# EasyEDA Pro project ProPrj_辉光管时钟V1.0_2025-10-09.epro, board 电源+控制
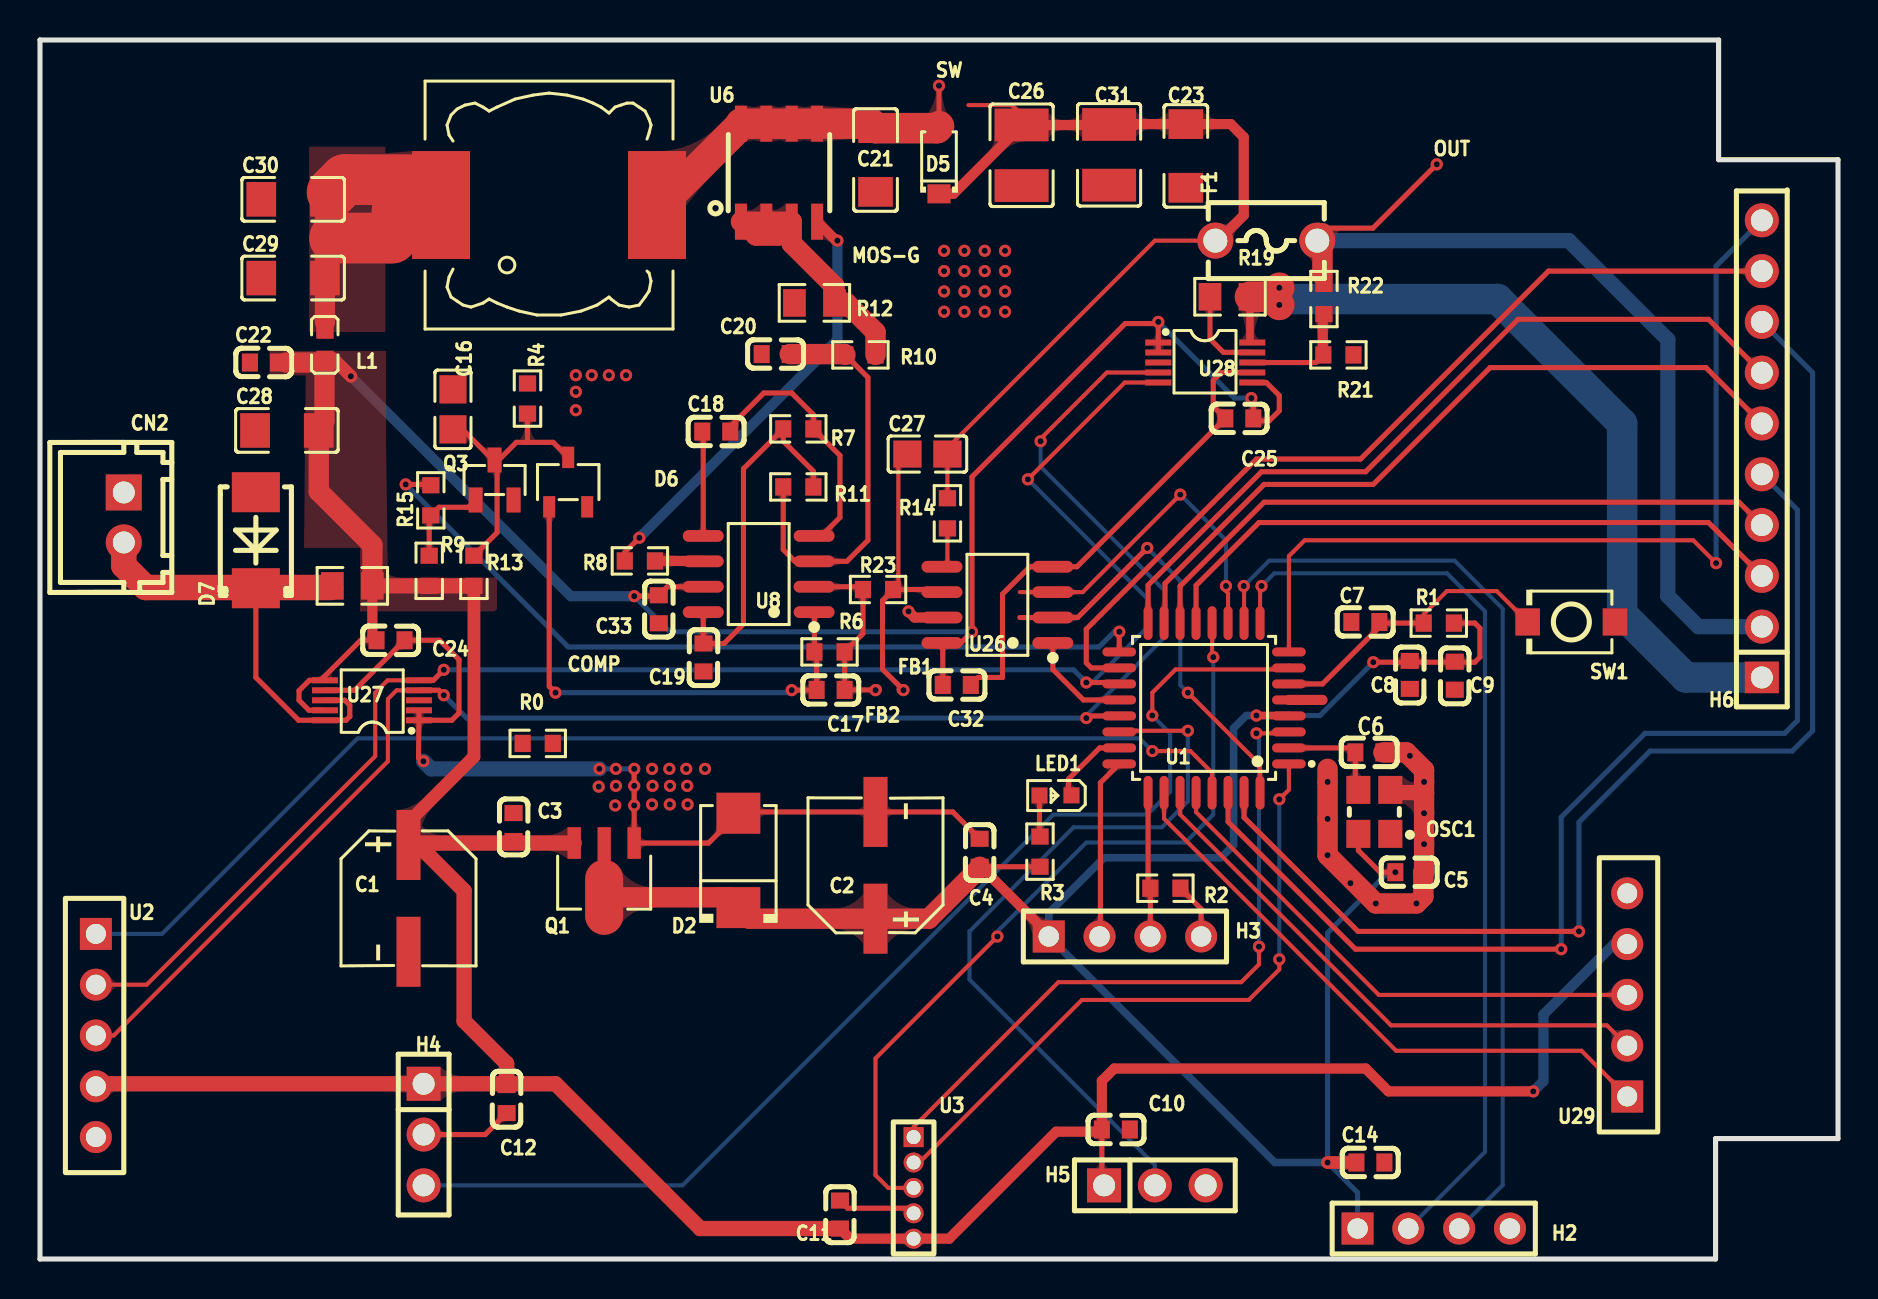
[diagram p6: board, top side]
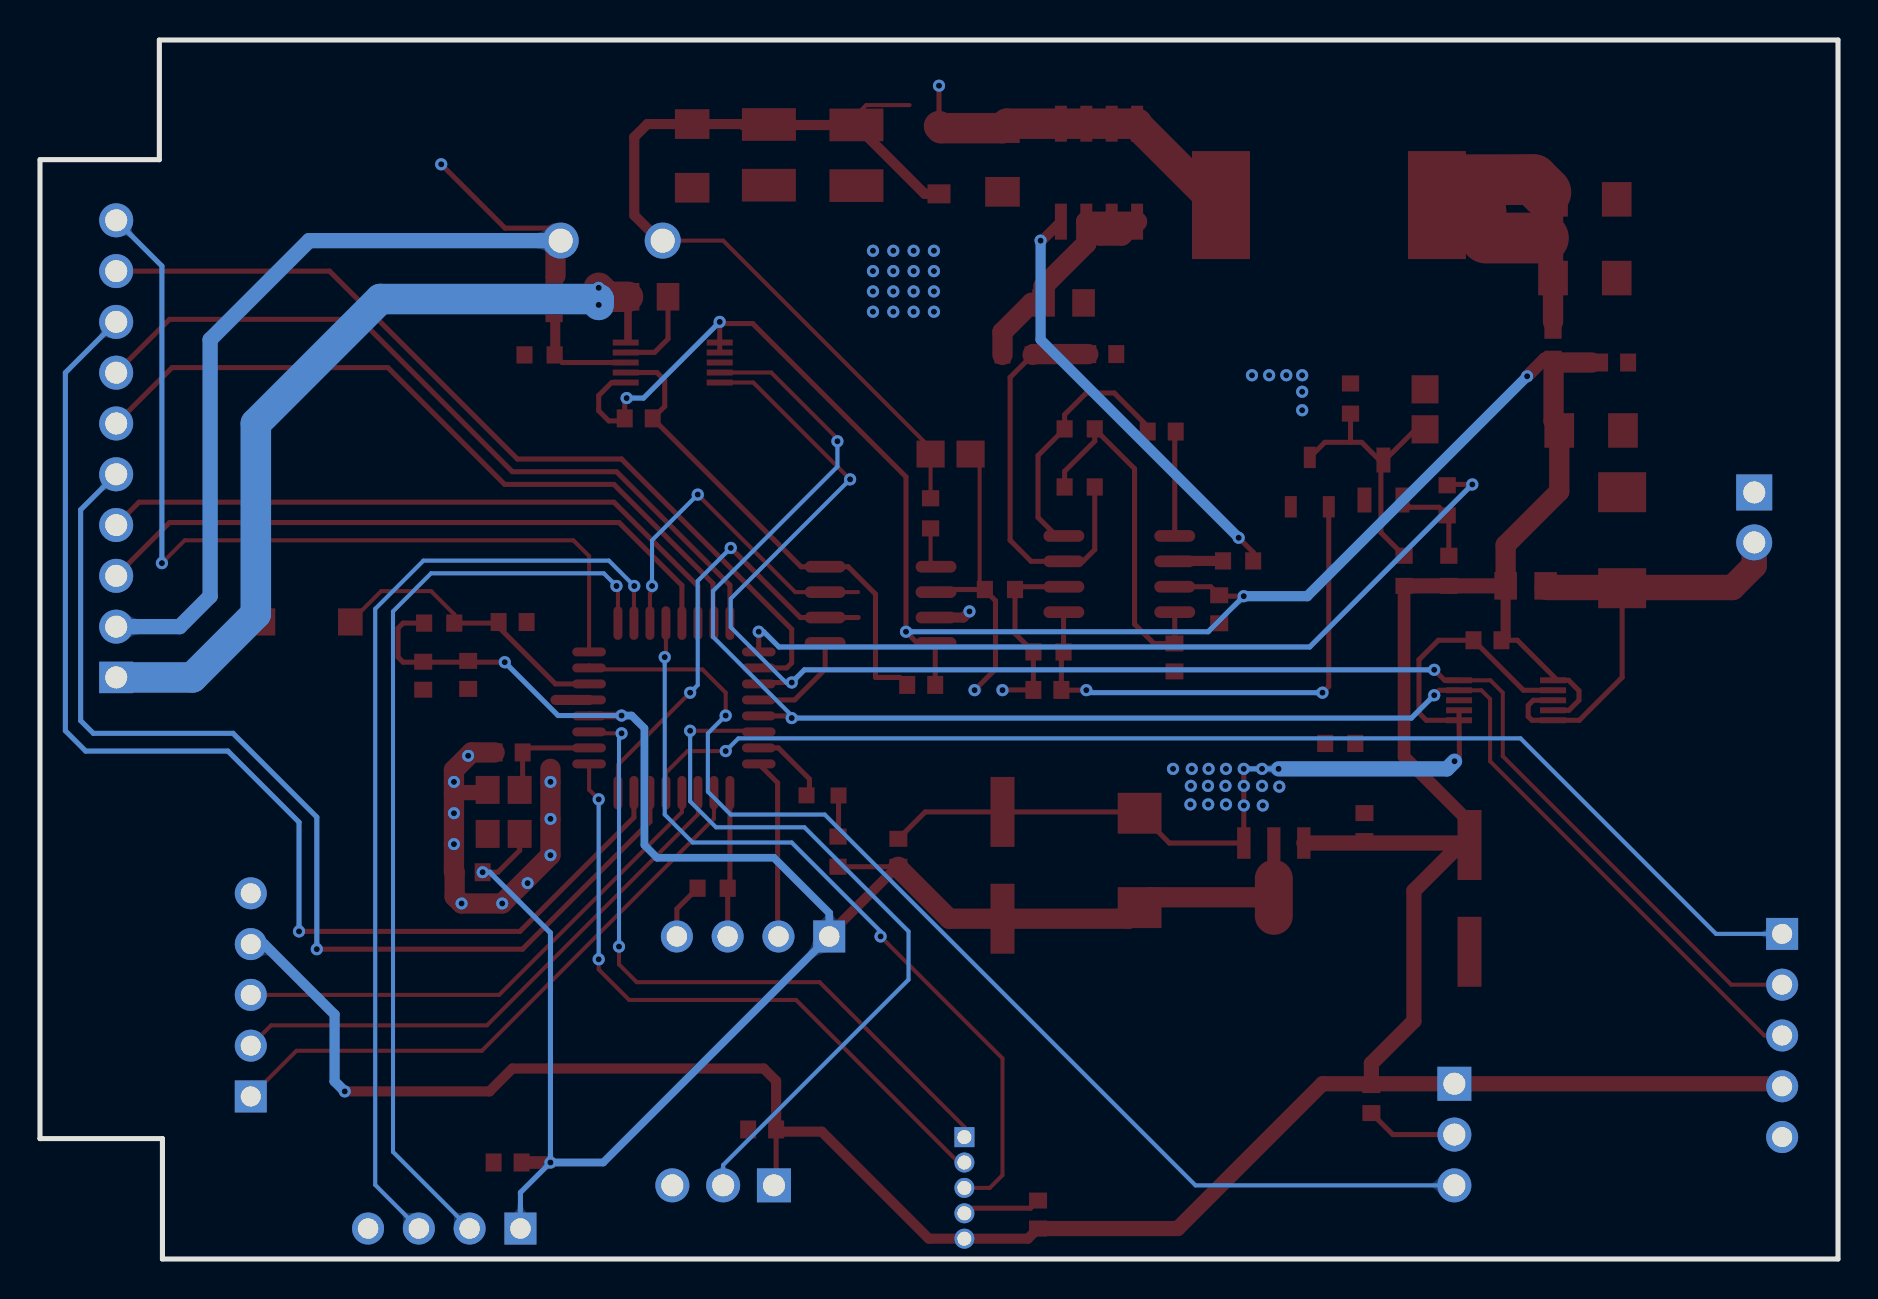
[diagram p7: board, bottom side, seen from below]

Outline 89.92 x 60.96 mm; copper layers: Top Layer, Bottom Layer. Coordinates in mm from the lower left corner of the outline.
Outline path: 0,60.96 0,0 83.79,0 83.79,6.02 89.92,6.02 89.92,54.97 83.95,54.97 83.95,60.96 0,60.96
Stack: Top Layer 0.035mm / Dielectric1 1.51mm FR4 er 4.5 / Bottom Layer 0.035mm

## Design rules (mm)
template: JLCPCB Capability(Two Layers Board)
spacing copperThickness1oz (default): track to track 0.102, other pairs 0.152 to 0.3
spacing copperThickness2oz: track to track 0.203, other pairs 0.152 to 0.3
track width copperThickness1oz (default): min 0.127, default 0.254, max 2.54
track width copperThickness2oz: min 0.203, default 0.254, max 2.54
differential pair differentialPair (default): width min 0.127, default 0.254, max 2.54; gap min 0.152, default 0.152
via viaSize (default): diameter min 0.5, default 0.61, max 10; hole min 0.3, default 0.305, max 6.3

## Placement (name value [footprint] x y rotation side)
C1  220uF  [CAP-SMD_BD6.3-L6.6-W6.6-FD]  18.43 18.03 270 top
C2  220uF  [CAP-SMD_BD6.3-L6.6-W6.6-FD]  41.78 19.69 90 top
C3  100nF  [C0603]  23.68 21.6 270 top
C4  100nF  [C0603]  46.99 20.31 270 top
C5  100nF  [C0603]  68.48 19.34 0 top
C6  15pF  [C0603]  66.48 25.33 0 top
C7  100nF  [C0603]  66.28 31.85 0 top
C8  100nF  [C0603]  68.5 29.21 90 top
C9  2.2nF  [C0603]  70.75 29.17 90 top
C10  100nF  [C0603]  53.8 6.48 180 top
C11  100nF  [C0603]  40 2.22 90 top
C12  100nF  [C0603]  23.34 8 90 top
C14  100nF  [C0603]  66.53 4.83 0 top
C16  47uF  [C0805]  20.65 42.49 270 top
C17  220pF  [c0603]  39.54 28.46 180 top
C18  430pF  [c0603]  33.82 41.38 0 top
C19  0.1uF  [c0603]  33.18 30.08 90 top
C20  1nF  [c0603]  36.79 45.25 0 top
C21  560pF  [c1206]  41.78 54.96 90 top
C22  0.1uF  [c0603]  11.2 44.83 0 top
C23  0.1uF  [c1206]  57.3 55.16 90 top
C24  0.1u  [C0603]  17.53 30.94 180 top
C25  0.1u  [C0603]  59.98 42.04 0 top
C26  2.2uF  [c1210]  49.09 55.2 90 top
C27  100pF  [C0805]  44.38 40.25 0 top
C28  100uF  [c1206]  12.35 41.43 0 top
C29  100uF  [c1206]  12.66 49.05 0 top
C30  100uF  [c1206]  12.66 52.99 0 top
C31  2.2uF  [c1210]  53.46 55.22 90 top
C32  0.1uF  [c0603]  45.85 28.71 180 top
C33  100nF  [C0603]  30.94 32.49 270 top
CN2  ZX-XH2.54-2PZZ  [CONN-TH_2P-P2.50_HX25003-2A]  4.19 37.08 270 top
COMP  -  [Test-Point-0.5mm]  25.8 28.33 0 top
D2  SMBJ3.3A  [SMB_L4.6-W3.6-LS5.3-RD]  34.93 19.93 90 top
D5  ES1J  [sod-123_l2.7-w1.6-ls3.6-rd]  44.96 54.96 90 top
D6  BAT54C,215  [SOT-23-3_L2.9-W1.6-P1.90-LS2.8-BR]  26.42 38.85 270 top
D7  SMBJ5.0A  [SMB_L4.4-W3.6-LS5.3-RD]  10.8 35.95 90 top
F1  JK250-080U  [FUSE-TH_L5.8-W3.8-P5.10-D0.8]  61.33 50.93 0 top
FB1  -  [Test-Point-0.5mm]  43.08 28.47 0 top
FB2  -  [Test-Point-0.5mm]  41.86 28.49 0 top
H2  排针  [SIP-2.54MM-4P-CJT-H8.54]  69.7 1.52 180 top
H3  排针  [SIP-2.54MM-4P-CJT-H8.54]  54.26 16.13 180 top
H4  PZ254V-11-03P  [HDR-TH_3P-P2.54-V-M]  19.19 6.22 270 top
H5  PZ254V-11-03P  [HDR-TH_3P-P2.54-V-M]  55.75 3.68 0 top
H6  MH254V-11-10-1196  [HDR-TH_10P-P2.54-V-M]  86.11 40.51 90 top
L1  10uH  [l0603]  14.25 45.72 90 top
L2  33uH  [33uh功率电感]  25.46 52.7 180 top
LED1  NCD0603R1  [LED0603-RD_RED]  50.78 23.18 180 top
MOS-G  -  [Test-Point-0.5mm]  39.89 50.9 0 top
OSC1  8MHz  [OSC-SMD_4P-L3.2-W2.5-BL-1]  66.73 22.36 90 top
OUT  -  [Test-Point-0.5mm]  69.85 54.75 0 top
Q1  AMS1117-3.3V  [SOT-89-3_L4.5-W2.5-P1.50-LS4.2-BR]  28.21 19.45 90 top
Q3  MMBT5551  [SOT-23-3_L2.9-W1.3-P1.90-LS2.4-BR]  22.73 38.96 270 top
R0  0欧姆  [R0603]  24.89 25.78 0 top
R1  50kΩ  [r0603]  69.95 31.8 0 top
R2  10kΩ  [r0603]  56.28 18.54 180 top
R3  220Ω  [r0603]  50.01 20.37 90 top
R4  100kΩ  [r0603]  24.38 43.03 270 top
R5  100mΩ  [R0805]  15.62 33.66 180 top
R6  10KΩ  [r0603]  39.48 30.36 180 top
R7  60.4kΩ  [r0603]  37.92 41.51 180 top
R8  2Ω  [r0603]  30 34.91 0 top
R9  100kΩ  [r0603]  19.46 34.41 270 top
R10  10kΩ  [r0603]  41.03 45.21 180 top
R11  51KΩ  [r0603]  37.92 38.61 0 top
R12  100mΩ  [R0805]  38.73 47.81 0 top
R13  2kΩ  [r0603]  21.7 34.41 270 top
R14  400kΩ  [r0603]  45.38 37.29 90 top
R15  1kΩ  [r0603]  19.54 37.94 90 top
R19  100mΩ  [R0805]  59.51 48.12 0 top
R21  1MΩ  [r0603]  64.93 45.21 0 top
R22  9.1MΩ  [r0603]  64.21 48.01 270 top
R23  5KΩ  [r0603]  41.91 33.48 180 top
SW  -  [Test-Point-0.5mm]  44.96 58.67 0 top
SW1  TS-1088R-02026  [SW-SMD_L3.9-W3.0-P4.45]  76.58 31.86 180 top
U1  STM32G070KBT6  [LQFP-32_L7.0-W7.0-P0.80-LS9.0-BL]  58.21 27.56 90 top
U2  -  [2.54mm1*5]  2.79 11.18 270 top
U3  FH1.27-01-5PZD  [HDR-TH_5P-P1.27-V-M]  43.69 3.56 270 top
U6  FDS2672  [SO-8_L4.9-W3.9-P1.27-LS6.0-BL]  36.96 54.33 0 top
U8  UCC3803D  [SOIC-8_L4.9-W3.9-P1.27-LS6.0-BL]  35.94 34.25 90 top
U26  MCP41010T-I/SN  [SOIC-8_L4.9-W3.9-P1.27-LS6.0-BL]  47.88 32.71 90 top
U27  INA220AIDGSR  [VSSOP-10_L3.0-W3.0-P0.50-LS4.9-BL]  16.6 27.94 90 top
U28  INA220AIDGSR  [VSSOP-10_L3.0-W3.0-P0.50-LS4.9-BL]  58.27 44.83 270 top
U29  -  [2.54mm1*5]  79.38 13.21 90 top

## Footprints (pads in the part's own frame, mm; a bottom-side part is the same pattern mirrored in y, then rotated)
2.54mm1*5
  rect 1.6x1.6 hole 1: 1(-5.08,0)
  round 1.6 hole 1: 2(-2.54,0) 3(0,0) 4(2.54,0) 5(5.08,0)
33uh功率电感
  rect 2.9x5.4 smd: 1(5.4,0) 2(-5.4,0)
c0603
  rect 0.8x0.9 smd: 1(-0.7,0) 2(0.7,0)
C0603
  rect 0.8x0.9 smd: 1(-0.7,0) 2(0.7,0)
C0805
  rect 1.41x1.35 smd: 1(-1,0) 2(1,0)
c1206
  rect 1.485x1.728 smd: 1(-1.593,0) 2(1.593,0)
c1210
  rect 1.635x2.7 smd: 1(-1.518,0) 2(1.518,0)
CAP-SMD_BD6.3-L6.6-W6.6-FD
  rect 3.5x1.2 smd: 1(-2.67,0) 2(2.67,0)
CONN-TH_2P-P2.50_HX25003-2A
  rect 1.8x1.8 hole 1.1: 1(-1.25,0)
  round 1.8 hole 1.1: 2(1.25,0)
FUSE-TH_L5.8-W3.8-P5.10-D0.8
  round 1.8 hole 1.2: 1(-2.55,0) 2(2.55,0)
HDR-TH_3P-P2.54-V-M
  rect 1.7x1.7 hole 1.1: 1(-2.54,0)
  round 1.7 hole 1.1: 2(0,0) 3(2.54,0)
HDR-TH_5P-P1.27-V-M
  rect 1x1 hole 0.7: 1(-2.54,0)
  round 1 hole 0.7: 2(-1.27,0) 3(0,0) 4(1.27,0) 5(2.54,0)
HDR-TH_10P-P2.54-V-M
  rect 1.575x1.7 hole 1.1: 1(-11.43,0)
  round 1.7 hole 1.1: 2(-8.89,0) 3(-6.35,0) 4(-3.81,0) 5(-1.27,0) 6(1.27,0) 7(3.81,0) 8(6.35,0) 9(8.89,0) 10(11.43,0)
l0603
  rect 0.8x0.864 smd: 1(-0.7,0) 2(0.7,0)
LED0603-RD_RED
  rect 0.8x0.8 smd: 1(-0.799,-0.004) 2(0.799,0.004)
LQFP-32_L7.0-W7.0-P0.80-LS9.0-BL
  oval 0.448x1.684 smd: 1(-2.8,-4.242) 2(-2,-4.242) 3(-1.2,-4.242) 4(-0.4,-4.242) 5(0.4,-4.242) 6(1.2,-4.242) 7(2,-4.242) 8(2.8,-4.242) 17(2.8,4.242) 18(2,4.242) 19(1.2,4.242) 20(0.4,4.242) 21(-0.4,4.242) 22(-1.2,4.242) 23(-2,4.242) 24(-2.8,4.242)
  oval 1.684x0.448 smd: 9(4.242,-2.8) 10(4.242,-2) 11(4.242,-1.2) 12(4.242,-0.4) 13(4.242,0.4) 14(4.242,1.2) 15(4.242,2) 16(4.242,2.8) 25(-4.242,2.8) 26(-4.242,2) 27(-4.242,1.2) 28(-4.242,0.4) 29(-4.242,-0.4) 30(-4.242,-1.2) 31(-4.242,-2) 32(-4.242,-2.8)
OSC-SMD_4P-L3.2-W2.5-BL-1
  rect 1.4x1.2 smd: 1(-1.1,-0.8) 2(1.1,-0.8) 3(1.1,0.8) 4(-1.1,0.8)
r0603
  rect 0.806x0.864 smd: 1(-0.753,0) 2(0.753,0)
R0603
  rect 0.806x0.864 smd: 1(-0.753,0) 2(0.753,0)
R0805
  rect 1.133x1.377 smd: 1(-1,0) 2(1,0)
SIP-2.54MM-4P-CJT-H8.54
  rect 1.6x1.6 hole 1.02: 1(3.81,0)
  round 1.6 hole 1.02: 2(1.27,0) 3(-1.27,0) 4(-3.81,0)
SMB_L4.4-W3.6-LS5.3-RD
  rect 2x2.4 smd: 1(-2.4,0) 2(2.4,0)
SMB_L4.6-W3.6-LS5.3-RD
  rect 2.047x2.192 smd: 1(-2.361,0) 2(2.361,0)
SO-8_L4.9-W3.9-P1.27-LS6.0-BL
  rect 0.6x1.8 smd: 1(-1.905,-2.45) 2(-0.635,-2.45) 3(0.635,-2.45) 4(1.905,-2.45) 5(1.905,2.45) 6(0.635,2.45) 7(-0.635,2.45) 8(-1.905,2.45)
sod-123_l2.7-w1.6-ls3.6-rd
  rect 0.95x1.15 smd: 1(-1.692,0) 2(1.692,0)
SOIC-8_L4.9-W3.9-P1.27-LS6.0-BL
  oval 0.588x2.045 smd: 1(-1.905,-2.772) 2(-0.635,-2.772) 3(0.635,-2.772) 4(1.905,-2.772) 5(1.905,2.772) 6(0.635,2.772) 7(-0.635,2.772) 8(-1.905,2.772)
SOT-23-3_L2.9-W1.3-P1.90-LS2.4-BR
  rect 1.25x0.7 smd: 1(1,-0.95) 2(1,0.95) 3(-1,0)
SOT-23-3_L2.9-W1.6-P1.90-LS2.8-BR
  rect 1.07x0.6 smd: 1(1.235,-0.95) 2(1.235,0.95) 3(-1.235,0)
SOT-89-3_L4.5-W2.5-P1.50-LS4.2-BR
  rect 1.575x0.672 smd: 1(1.356,-1.5) 3(1.356,1.5)
  custom 5.377x1.9 smd: 2(-1.356,0)
SW-SMD_L3.9-W3.0-P4.45
  rect 1.23x1.36 smd: 1(-2.185,0) 2(2.185,0)
Test-Point-0.5mm
  round 0.5 smd: 1(0,0)
VSSOP-10_L3.0-W3.0-P0.50-LS4.9-BL
  rect 0.3x1.3 smd: 1(-1,-2.35) 2(-0.5,-2.35) 3(0,-2.35) 4(0.5,-2.35) 5(1,-2.35) 6(1,2.35) 7(0.5,2.35) 8(0,2.35) 9(-0.5,2.35) 10(-1,2.35)

## Nets
As in the schematic, except:
17V: R21.1 R22.2 U28.8
170V: F1.2 H6.2 OUT.1 R22.1
+3.3V: C2.1 C4.2 C5.1 C8.2 C9.2 C14.1 D2.1 H2.1 H3.1 OSC1.4 Q1.2 R1.2 R3.1 U1.4
GND: C2.2 C4.1 C5.2 C6.2 C7.1 C8.1 C9.1 C10.1 C11.2 C12.1 C14.2 C18.1 C19.1 C24.1 C25.1 C32.1 C33.2 D2.2 H2.4 H3.4 H4.2 H5.3 OSC1.2 Q1.1 R0.2 R2.1 SW1.1 U1.5 U2.5 U3.4 U8.5 U26.4 U27.1 U27.2 U27.7 U28.7 U29.5
PGND: C1.2 C3.1 C16.1 C20.1 C21.1 C22.1 C23.1 C26.1 C28.1 C29.1 C30.1 C31.1 CN2.1 D7.2 Q3.2 R0.1 R4.1 R12.1 R19.1 R21.2 U26.7 U28.9
POWER: R15.2 U1.17

Pads without a net: D6 2; OSC1 1; U27 3; U28 3

## Via types
v1: diameter 0.61, hole 0.305, Top Layer to Bottom Layer, 98 vias

## Routing (per net, layer and track width the routed paths; a pad name or vN(x,y) marks a point on that pad's centre or on a via; arc(x,y) is an arc through that point)
17V: length 5.9
  Top Layer w0.254: 64.15,45.19 63.8,44.83 U28.8 ; 64.17,45.2 R21.1
  Top Layer w0.508: 64.14,47.42 64.14,47.26 64.15,47.24 64.15,45.22 ; 64.17,45.2 64.15,45.19
170V: length 47.1
  Top Layer w0.254: v1(69.85,54.75) 66.66,51.55 63.88,51.55
  Top Layer w1.016: 64.14,49.18 64.14,51.3
  Bottom Layer w0.762: 63.88,50.93 76.45,50.93 81.41,45.97 81.41,33.15 82.93,31.62 H6.2
+3.3V: length 107.5
  Top Layer w0.254: 50.01,19.62 46.99,19.62 C4.2 ; R1.2 71.75,31.8 72.01,31.55 72.01,30.1 71.75,29.84 v1(66.68,29.84) ; OSC1.4 65.93,20.43 67.02,19.34 v1(67.78,19.34)
  Top Layer w0.381: v1(60.83,27.18) 62.44,27.18 U1.4
  Top Layer w0.508: H3.1 50.45,16.23 47.12,19.56 46.99,19.56
  Top Layer w0.635: C14.1 v1(64.39,4.83)
  Top Layer w1.016: 28.21,18.09 34.41,18.09 D2.1 35.48,17.02 C2.1 44.45,17.02 46.99,19.56 C4.2
  Bottom Layer w0.254: v1(67.78,19.34) 67.42,19.34 64.39,16.31 v1(64.39,4.83) 65.89,3.32 H2.1 ; v1(66.68,29.84) 64.01,27.18 v1(60.83,27.18)
  Bottom Layer w0.381: v1(60.83,27.18) 60.33,27.18 59.69,26.54 59.69,20.7 59.06,20.07 53.21,20.07 50.45,17.3 H3.1 61.75,4.83 v1(64.39,4.83)
+5V: length 237.7
  Top Layer w0.254: U28.2 U28.1 55.92,46.78 ; U27.9 13.45,27.44 12.95,27.94 12.95,28.42 13.47,28.94 14.03,28.94 ; C24.2 16.04,30.94 14.03,28.94 ; H5.1 53.1,3.79 53.1,6.37 ; U27.6 14.03,28.94 ; v1(60.58,43.05) 60.68,42.96 C25.2 60.8,41.91 61.47,41.91 61.98,42.42 61.98,43.18 61.33,43.83 U28.6 ; C32.2 45.15,30.77 U26.8 46.05,30.81 v1(46.61,31.37) 46.61,39.12 54.27,46.78 55.92,46.78 ; U8.7 31.37,33.62 C33.1 30.9,33.15 v1(29.72,33.15) ; 55.92,46.78 v1(55.92,46.86)
  Top Layer w0.508: 40,1.52 40.51,1.02 U3.5 45.47,1.02 50.82,6.37 53.1,6.37 53.1,8.91 53.72,9.53 66.29,9.53 67.44,8.38 v1(74.68,8.38) ; C24.2 16.62,31.15 R5.1
  Top Layer w0.635: v1(15.55,44.14) 14.67,45.02 L1.1 ; R13.2 21.7,25.12 18.43,21.84 C1.1
  Top Layer w0.762: 40,1.52 33.02,1.52 25.78,8.76 23.4,8.76 C12.2 ; C12.2 23.27,8.76 H4.1 2.92,8.76 U2.4 ; C12.2 23.34,9.78 21.21,11.9 21.21,18.42 18.92,20.7 C1.1 18.53,20.8 26.71,20.8 ; R5.1 R9.2 R13.2
  Top Layer w1.016: R5.1 16.62,35.7 13.94,38.38 C28.2 13.94,41.63 14.22,41.91 14.22,44.7 ; 14.1,44.83 12.32,44.83
  Bottom Layer w0.254: v1(55.92,46.86) 59.73,43.05 v1(60.58,43.05) ; v1(29.72,33.15) 31.5,31.37 v1(46.61,31.37)
  Bottom Layer w0.508: U29.4 78.71,15.75 75.18,12.22 75.18,8.89 v1(74.68,8.38) ; v1(15.55,44.14) 26.54,33.15 v1(29.72,33.15)
GND: length 112.7
  Top Layer w0.254: v1(19.18,24.89) 18.93,25.06 U27.1 ; C4.1 45.65,22.36 C2.2 34.99,22.36 D2.2 33.43,20.8 29.71,20.8 v1(29.71,22.68) v1(29.71,23.66) 29.71,24.51 v1(29.72,24.51) ; C12.1 22.26,6.22 H4.2 ; 40,2.92 40.39,2.54 43.43,2.54 U3.4 ; H3.4 58.07,17.51 R2.1 ; U28.7 59.06,44.33 58.67,43.94 58.67,42.64 C25.1 51.86,34.62 U26.4 49.5,34.62 48.13,33.25 48.13,29.08 46.92,29.08 C32.1 ; U8.5 33.17,41.33 C18.1 ; U27.2 U27.1 ; U27.1 20.59,26.94 20.96,27.31 20.96,29.97 19.99,30.94 C24.1 15.73,28.44 U27.7 ; 30.78,31.62 C33.2
  Top Layer w0.508: U1.5 64.14,27.96
  Top Layer w0.762: 69.22,23.33 67.53,23.33
  Top Layer w1.016: C6.2 68.33,25.33 69.22,24.45 v1(69.22,23.86) v1(69.22,22.29) v1(69.22,20.75) 69.22,19.38 C5.2 69.18,18.13 v1(68.83,17.78) v1(66.8,17.78) v1(64.39,20.19) v1(64.39,22.01) v1(64.39,23.86) 64.39,24.51
  Bottom Layer w0.254: v1(29.72,24.51) v1(28.8,24.51) v1(27.98,24.51)
  Bottom Layer w0.762: v1(19.18,24.89) 19.56,24.51 v1(27.98,24.51)
  vias: v1(27.94,23.62) v1(28.8,23.66) v1(28.77,22.68) v1(30.61,24.51) v1(30.63,23.66) v1(30.61,22.73) v1(31.47,24.51) v1(31.51,23.66) v1(31.5,22.73) v1(32.32,24.51) v1(32.37,23.66) v1(32.39,22.73) v1(33.26,24.51) v1(65.53,18.8) v1(68.5,25.16)
PGND: length 6.3
  Top Layer w0.254: R19.1 58.51,46.01 59.18,45.34 60.62,45.34 U28.9
  Top Layer w0.508: v1(43.43,32.39) 43.74,32.08 U26.7
  vias: v1(26.8,44.2) v1(26.8,43.37) v1(26.8,42.45) v1(27.59,44.2) v1(28.45,44.2) v1(29.31,44.2) v1(45.21,50.42) v1(45.21,49.4) v1(45.21,48.39) v1(45.21,47.37) v1(46.23,50.42) v1(46.23,49.4) v1(46.23,48.39) v1(46.23,47.37) v1(47.24,50.42) v1(47.24,49.4) v1(47.24,48.39) v1(47.24,47.37) v1(48.26,50.42) v1(48.26,49.4) v1(48.26,48.39) v1(48.26,47.37)
VBUS: length 23.4
  Top Layer w0.254: U27.8 15.24,27.94 15.49,27.69 15.49,27.13 15.3,26.94 U27.10 12.94,26.94 10.8,29.08 10.8,33.54 10.75,33.58
  Top Layer w1.27: 4.19,35.2 4.19,34.67 5.28,33.58 14.54,33.58
170_GND: length 42.2
  Top Layer w0.381: R19.2 60.51,45.95
  Top Layer w1.524: R19.2 61.53,48.12 v1(61.98,48.57) ; v1(61.98,47.71) 61.57,48.12
  Bottom Layer w1.524: H6.1 82.3,29.08 79.12,32.26 79.12,41.78 72.9,48.01 61.99,48.01 61.98,47.99 v1(61.98,47.71)
BLE_RX: length 48.2
  Top Layer w0.203: U1.10 60.21,33.64 v1(60.2,33.66)
  Bottom Layer w0.203: v1(60.2,33.66) 61.47,34.93 70.74,34.93 73.15,32.51 73.15,3.71 H2.3
BLE_TX: length 46.6
  Top Layer w0.203: U1.9 61.01,33.58 v1(61.09,33.66)
  Bottom Layer w0.203: H2.2 72.26,5.36 72.26,32.39 70.36,34.29 61.72,34.29 v1(61.09,33.66)
CLK: length 26.3
  Top Layer w0.203: U29.3 66.95,13.21 57.81,22.35 U1.28
COLON1: length 54.2
  Top Layer w0.254: v1(76.07,15.49) 65.79,15.49 59.41,21.87 59.41,23.32
  Bottom Layer w0.254: H6.5 87.88,37.47 87.88,26.92 87.25,26.29 80.26,26.29 76.07,22.1 v1(76.07,15.49)
COLON2: length 60.9
  Top Layer w0.254: U1.31 60.21,22.08 65.91,16.38 v1(76.96,16.38)
  Bottom Layer w0.254: v1(76.96,16.38) 76.96,21.84 80.52,25.4 87.63,25.4 88.65,26.42 88.65,44.32 H6.8
CS: length 28.2
  Top Layer w0.203: U1.27 57.01,22.23 67.56,11.68 78.36,11.68 U29.2
DS3231: length 61.6
  Top Layer w0.203: v1(55.63,25.4) 57.53,25.4 58.61,24.32 U1.29
  Bottom Layer w0.203: U2.1 6.1,16.26 15.88,26.04 54.99,26.04 v1(55.63,25.4)
I2C1_SCL: length 82.4
  Top Layer w0.203: v1(49.4,38.99) 54.25,43.83 U28.5 ; U27.5 17.38,28.94 16.76,28.32 16.76,25.15 5.34,13.72 U2.2
  Top Layer w0.254: v1(52.32,28.83) 53.9,28.83 U1.19 ; v1(20.19,29.46) 19.67,28.94 U27.5
  Bottom Layer w0.203: v1(49.4,38.99) 55.37,33.02 55.37,31.59 52.61,28.83 v1(52.32,28.83)
  Bottom Layer w0.254: v1(52.32,28.83) 51.69,29.46 v1(20.19,29.46)
I2C1_SDA: length 86.2
  Top Layer w0.203: U2.3 3.68,11.18 17.4,24.89 17.4,28 17.84,28.44 U27.4 ; U28.4 53.35,44.33 50.04,41.02 v1(50.04,40.89)
  Top Layer w0.254: U1.21 52.43,27.16 v1(52.32,27.05) ; U27.4 19.95,28.44 v1(20.19,28.19)
  Bottom Layer w0.203: v1(50.04,40.89) 50.04,39.62 56.26,33.4 56.26,31.12 52.32,27.18 v1(52.32,27.05)
  Bottom Layer w0.254: v1(52.32,27.05) 21.34,27.05 v1(20.19,28.19)
INFRARED-RAY: length 37.1
  Top Layer w0.203: U1.22 54.03,26.42 v1(57.4,26.42)
  Bottom Layer w0.203: H5.2 55.75,4.7 46.48,13.97 46.48,16.38 51.69,21.59 56.11,21.59 57.4,22.89 v1(57.4,26.42)
LED: length 4.1
  Top Layer w0.254: U1.23 52.99,25.56 51.44,24 51.44,23.33 LED1.1
LIGHT_ADC: length 58.2
  Top Layer w0.203: v1(55.63,27.18) 55.63,28.32 56.79,29.48 62.25,29.48 62.46,29.69
  Bottom Layer w0.203: H4.3 32.13,3.68 50.67,22.23 55.37,22.23 56.52,23.37 56.52,26.29 v1(55.63,27.18)
MOSI: length 30.2
  Top Layer w0.203: U29.1 77.09,10.41 67.82,10.41 56.21,22.02 U1.26
NRST: length 14.6
  Top Layer w0.203: R1.1 69.2,32.24 70.36,33.4 72.85,33.4 SW1.2
  Top Layer w0.254: 69.07,31.8 67.03,31.8 C7.2 ; U1.6 64.14,28.76 66.98,31.6
OSC_IN: length 5.6
  Top Layer w0.254: 65.85,23.4 65.93,23.33 OSC1.3 65.78,23.61 C6.1 65.55,25.56 U1.2
POWER: length 41.7
  Top Layer w0.254: U1.17 53.97,31.37 v1(53.97,31.37) ; R15.2 19.5,38.73 v1(18.29,38.73)
  Bottom Layer w0.254: v1(53.97,31.37) 53.72,31.37 52.96,30.61 26.42,30.61 v1(18.29,38.73)
RADER: length 34.4
  Top Layer w0.203: v1(60.83,26.29) 62.39,26.29 U1.3 ; U3.1 43.69,6.6 50.93,13.84 60.07,13.84 60.96,14.73 v1(60.96,15.62)
  Bottom Layer w0.203: v1(60.83,26.29) 60.96,26.16 v1(60.96,15.62)
RADER_RX: length 32.8
  Top Layer w0.203: v1(61.98,22.99) 62.46,23.47 U1.1 ; v1(61.98,14.99) 61.98,14.48 60.45,12.95 52.1,12.95 43.98,4.83 43.69,4.83
  Bottom Layer w0.203: v1(61.98,14.99) v1(61.98,22.99)
RADER_TX: length 39.7
  Top Layer w0.203: v1(58.67,30.1) 58.61,30.16 U1.12 ; v1(47.88,16.13) 41.78,10.03 41.78,4.19 42.42,3.56 U3.3
  Bottom Layer w0.203: v1(47.88,16.13) 47.88,16.38 52.32,20.83 57.28,20.83 58.67,22.23 v1(58.67,30.1)
SPI_CS: length 5.3
  Top Layer w0.254: U1.20 52.18,27.96 50.65,29.49 U26.1
SPI_MOSI: length 17.4
  Top Layer w0.203: 59.18,33.53 59.41,33.3 59.41,31.8 ; 49,33.35 U26.3 52.15,33.35 v1(57.02,38.23)
  Bottom Layer w0.203: v1(59.31,33.66) 59.31,35.94 v1(57.02,38.23)
SPI_SCK: length 22.4
  Top Layer w0.203: U1.32 61.01,24.71 v1(57.4,28.32)
  Top Layer w0.254: v1(55.37,35.56) 51.89,32.08 49,32.08
  Bottom Layer w0.203: v1(57.4,28.32) 57.02,28.7 57.02,33.91 v1(55.37,35.56)
SWCLK: length 7.2
  Top Layer w0.254: H3.3 R2.2 55.41,18.65 55.41,23.32
SWDIO: length 8.9
  Top Layer w0.254: 53.03,16.26 53.03,23.82 U1.24
SWITCH1: length 32.6
  Top Layer w0.254: H6.3 83.44,36.83 60.96,36.83 57.81,33.68 U1.13
SWITCH2: length 33.2
  Top Layer w0.254: U1.14 57.01,33.65 61.21,37.85 84.96,37.85 H6.4
SWITCH3: length 37.5
  Top Layer w0.254: U1.15 56.26,31.85 56.26,33.78 61.21,38.73 66.68,38.73 72.52,44.58 83.31,44.58 H6.6
SWITCH4: length 39.2
  Top Layer w0.254: 55.41,31.8 55.41,33.7 61.09,39.37 66.29,39.37 73.91,46.99 83.44,46.99 H6.7
SWITCH5: length 44.6
  Top Layer w0.254: H6.9 75.44,49.4 66.04,40.01 60.83,40.01 52.32,31.5 52.32,29.81 52.58,29.56 U1.18
SWITCH6: length 45
  Top Layer w0.203: U1.8 62.46,35.15 63.25,35.94 82.68,35.94 v1(83.82,34.8)
  Bottom Layer w0.254: v1(83.82,34.8) 83.82,49.66 H6.10
$1N3438: length 2.1
  Top Layer w0.254: R3.2 49.98,21.15 LED1.2
$3N2608: length 4.6
  Top Layer w0.254: R9.1 19.46,37.1 R15.1 19.95,37.59 21.42,37.59 Q3.1
$3N2615: length 13
  Top Layer w0.254: 34.27,41.38 36.19,43.31 37.59,43.31 38.68,42.22 38.68,41.51 40,40.18 40,37.08 39.08,36.16 U8.4
$3N2617: length 21.8
  Top Layer w0.254: v1(29.97,36.07) 29.25,35.34 R8.1
  Top Layer w0.508: v1(39.88,50.93) 39.81,50.93 U6.4
  Bottom Layer w0.508: v1(29.97,36.07) 39.88,45.97 v1(39.88,50.93)
$3N2618: length 2.4
  Top Layer w0.508: U8.6 33.15,34.91 R8.2
$3N2620: length 17.8
  Top Layer w0.254: v1(44.96,58.67) D5.2
  Top Layer w1.524: 31.05,52.72 35.05,56.72 U6.8 U6.7 U6.6 U6.5 41.56,56.78 C21.2 44.86,56.55 D5.2
$3N2623: length 14.3
  Top Layer w1.016: U6.3 U6.2 35.12,51.88 ; U6.3 36.9,51.18 35.81,51.18 35.12,51.88 ; U6.3 37.59,50.78 39.73,48.65 R12.2 40.33,47.81 41.78,46.36 R10.1 ; 35.12,51.88 U6.1
$3N2624: length 20.6
  Top Layer w0.254: R11.1 37.17,35.47 37.76,34.89 U8.3 40.35,34.89 41.4,35.94 41.4,44.09 40.28,45.21
  Top Layer w1.016: 40.28,45.21 40.24,45.25 C20.2
$3N2625: length 18.1
  Top Layer w0.254: U8.8 33.17,30.8 C19.2 34.21,30.78 35.18,31.75 35.18,39.52 R7.2 37.17,40.9 38.68,39.39 38.68,38.61
$3N2628: length 13.6
  Top Layer w0.254: 24.38,40.84 23.82,40.84 22.86,39.88 22.86,39.75 ; 24.38,40.84 25.66,40.84 D6.3 26.54,39.96 ; 24.38,40.84 24.38,41.9 ; 22.86,39.75 22.86,36.33 R13.1 ; 22.86,39.75 21.12,41.49 C16.2
$3N2629: length 26.5
  Top Layer w0.254: U8.1 38.73,32.33 R6.2 38.84,30.25 C17.2 38.83,28.45 v1(37.59,28.45) ; D6.1 25.47,28.64 v1(25.78,28.32)
  Bottom Layer w0.254: v1(25.78,28.32) 37.47,28.32 v1(37.59,28.45)
$3N2630: length 18.8
  Top Layer w1.016: C30.2 C29.2 14.25,46.86
  Top Layer w2.032: 17.61,51.05 17.61,52.4 17.78,52.58 19.49,52.58
  Top Layer w2.54: 14.61,53.35 15.25,53.98 19.49,53.97 19.49,52.58 ; 17.61,51.05 14.73,51.05
$3N2637: length 46.5
  Top Layer w0.203: R14.2 C27.2 45.38,40.55 55.75,50.93 F1.1 ; 49.6,56.71 48.6,57.7 46.43,57.7
  Top Layer w0.508: 58.92,51.44 59.18,51.18 60.2,52.2 60.2,56.1 59.54,56.76 C23.2 54.81,56.76 54.76,56.71 49.12,56.71 45.68,53.27 D5.1
$3N2638: length 9.5
  Top Layer w0.254: FB2.1 41.82,28.46 C17.1 40.24,30.36 R6.1 41.16,31.28 R23.2 41.02,33.62 U8.2
  vias: v1(41.78,28.45)
$3N2640: length 2
  Top Layer w0.203: U26.5 45.38,34.89 R14.1
$3N2641: length 15.3
  Top Layer w0.203: C27.1 42.93,39.8 42.93,33.74 R23.1
  Top Layer w0.254: v1(43.18,28.45) 42.13,29.5 42.13,32.92 42.66,33.45 R23.1 44.98,33.48 U26.6

## Copper pours and planes (outline as drawn; the poured copper is in the pictures)
+5V on Top Layer: 11.48,45.41 22.86,45.41 22.86,32.39 11.48,32.39
GND on Top Layer: 63.51,35.49 81.13,35.49 82.04,34.65 82.04,26.16 91.7,26.16 91.58,11.42 91.58,0.31 91.57,-1.65 50.67,-1.4 50.42,-1.65 50.42,1.78 50.55,1.91 56.38,1.91 56.89,2.41 56.89,5.08 56.52,5.46 53.85,5.46 53.72,5.59 53.72,8 54.48,8.76 65.62,8.76 67.99,6.4 80.77,6.4 80.77,16.89 70.59,16.89 70.59,26.55 63.51,26.55
GND on Top Layer: 33.66,42.42 33.66,40.39 33.91,40.13 34.67,40.13 34.67,35.81 34.42,35.56 28.45,35.56 28.45,32.89 28.83,32.51 31.23,32.51 31.75,31.99 31.75,30.1 34.29,30.1 35.31,31.12 37.58,31.12 37.58,27.58 38.1,27.05 45.83,27.05 45.83,30.23 47.12,30.23 47.12,36.65 48.57,38.1 52.32,38.1 58.67,44.45 59.94,44.45 59.94,40.25 53.59,33.9 49.27,33.9 49.27,29.72 52.58,26.42 52.71,26.42 52.71,24.64 52.45,24.38 50.67,24.38 50.55,24.26 50.55,20.45 43.52,20.45 30.94,19.82 29.24,19.82 29.24,22.04 25.02,22.04 25.02,35.81 26.16,36.96 28.19,36.96 28.19,42.42
GND on Bottom Layer: -0.89,7.37 25.15,7.37 27.18,9.4 27.18,26.01 48.77,26.01 48.77,14.61 49.53,13.84 56.77,13.84 56.77,19.94 62.53,19.94 62.53,26.83 92.43,26.86 92.46,-2.67 -0.38,-2.67 -0.76,-3.05 -0.76,7.11 -0.89,7.24
PGND on Top Layer: -16.13,67.95 103.63,67.95 103.63,-5.33 -16.13,-5.33
PGND on Bottom Layer: -16.51,70.23 103.25,70.23 103.25,-3.05 -16.51,-3.05
$3N2630 on Top Layer: 13.46,55.63 17.27,55.63 17.27,46.36 13.46,46.36

Small or netless copper shapes (teardrops, artwork), in the pictures only: 305 on Top Layer, 64 on Bottom Layer

## Text on the board
Top Layer: 信号 | 上下翻转，右边放排针，下面放蓝牙红外线和雷达，中间放芯片，左边放电源
Top Silkscreen Layer: C6
